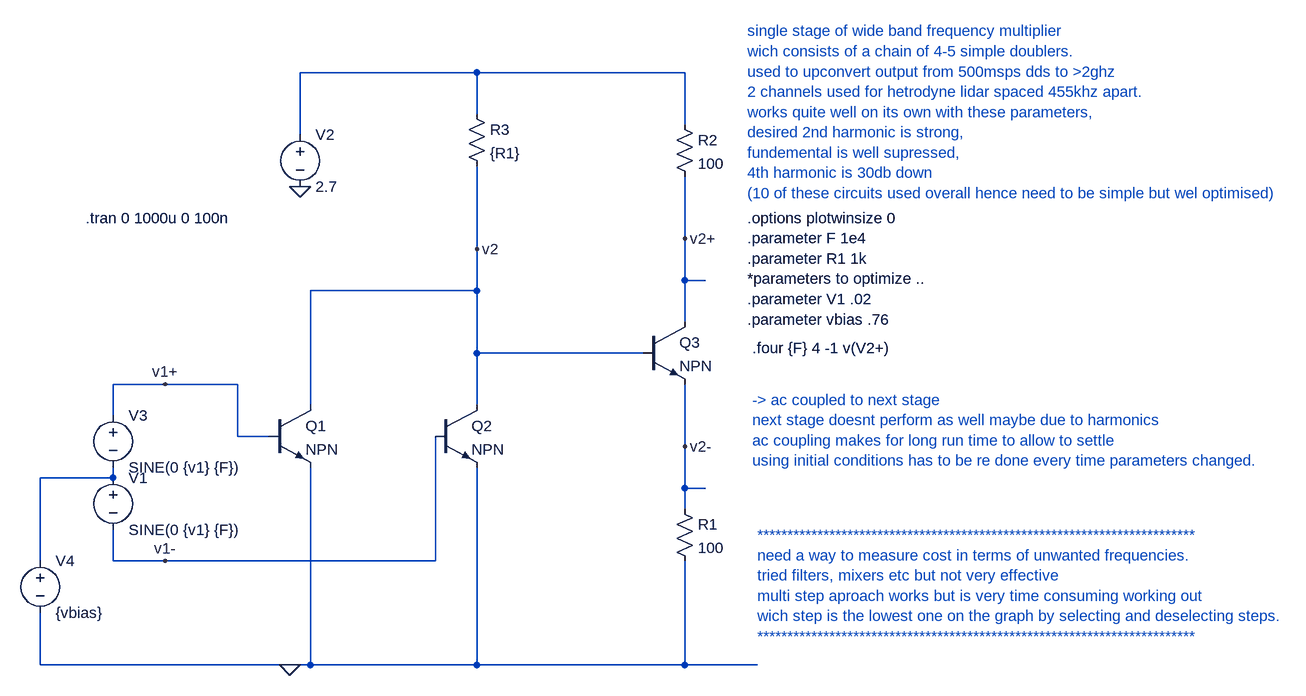
[diagram p0: schematic mul_x2_a.asc]
mul_x2_a.asc, the LTspice schematic file:
Version 4
SHEET 1 4328 788
WIRE -336 480 -336 352
WIRE -336 640 -336 560
WIRE -224 256 -224 208
WIRE -224 352 -336 352
WIRE -224 352 -224 336
WIRE -224 480 -224 432
WIRE -144 208 -224 208
WIRE -144 480 -224 480
WIRE -32 208 -144 208
WIRE -32 288 -32 208
WIRE 16 288 -32 288
WIRE 48 640 -336 640
WIRE 64 -176 64 -272
WIRE 80 240 80 64
WIRE 80 640 48 640
WIRE 80 640 80 336
WIRE 272 480 -144 480
WIRE 272 480 272 288
WIRE 336 -272 64 -272
WIRE 336 -208 336 -272
WIRE 336 0 336 -128
WIRE 336 64 80 64
WIRE 336 64 336 0
WIRE 336 160 336 64
WIRE 336 240 336 160
WIRE 336 640 80 640
WIRE 336 640 336 336
WIRE 592 160 336 160
WIRE 656 -272 336 -272
WIRE 656 -192 656 -272
WIRE 656 -16 656 -112
WIRE 656 48 656 -16
WIRE 656 112 656 48
WIRE 656 304 656 208
WIRE 656 368 656 304
WIRE 656 400 656 368
WIRE 656 640 336 640
WIRE 656 640 656 480
WIRE 688 48 656 48
WIRE 688 368 656 368
WIRE 768 640 656 640
FLAG 64 -96 0
FLAG 48 640 0
FLAG 656 -16 v2+
FLAG 656 304 v2-
FLAG -144 208 v1+
FLAG -144 480 v1-
FLAG 336 0 v2
SYMBOL npn 16 240 R0
SYMATTR InstName Q1
SYMBOL npn 272 240 R0
SYMATTR InstName Q2
SYMBOL npn 592 112 R0
SYMATTR InstName Q3
SYMBOL res 640 384 R0
SYMATTR InstName R1
SYMATTR Value 100
SYMBOL res 640 -208 R0
SYMATTR InstName R2
SYMATTR Value 100
SYMBOL res 320 -224 R0
SYMATTR InstName R3
SYMATTR Value {R1}
SYMBOL voltage -224 336 R0
WINDOW 123 0 0 Left 0
WINDOW 39 0 0 Left 0
SYMATTR InstName V1
SYMATTR Value SINE(0 {v1} {F})
SYMBOL voltage 64 -192 R0
WINDOW 123 0 0 Left 0
WINDOW 39 0 0 Left 0
SYMATTR InstName V2
SYMATTR Value 2.7
SYMBOL voltage -224 240 R0
WINDOW 123 0 0 Left 0
WINDOW 39 0 0 Left 0
SYMATTR InstName V3
SYMATTR Value SINE(0 {v1} {F})
SYMBOL voltage -336 464 R0
WINDOW 123 0 0 Left 0
WINDOW 39 0 0 Left 0
SYMATTR InstName V4
SYMATTR Value {vbias}
TEXT -266 -48 Left 0 !.tran 0 1000u 0 100n
TEXT 752 -48 Left 0 !.options plotwinsize 0\n.parameter F 1e4\n.parameter R1 1k\n*parameters to optimize ..\n.parameter V1 .02\n.parameter vbias .76
TEXT 760 232 Left 0 ;-> ac coupled to next stage\nnext stage doesnt perform as well maybe due to harmonics\nac coupling makes for long run time to allow to settle\nusing initial conditions has to be re done every time parameters changed.
TEXT 752 -336 Left 0 ;single stage of wide band frequency multiplier \nwich consists of a chain of 4-5 simple doublers.\nused to upconvert output from 500msps dds to >2ghz\n2 channels used for hetrodyne lidar spaced 455khz apart.\nworks quite well on its own with these parameters, \ndesired 2nd harmonic is strong,\nfundemental is well supressed,\n4th harmonic is 30db down\n(10 of these circuits used overall hence need to be simple but wel optimised)
TEXT 768 440 Left 0 ;*************************************************************************\nneed a way to measure cost in terms of unwanted frequencies.\ntried filters, mixers etc but not very effective\nmulti step aproach works but is very time consuming working out \nwich step is the lowest one on the graph by selecting and deselecting steps.\n*************************************************************************
TEXT 760 152 Left 0 !.four {F} 4 -1 v(V2+)

The netlist it stands for:
* mul_x2_a.asc
Q1 v2 v1+ 0 0 NPN
Q2 v2 v1- 0 0 NPN
Q3 v2+ v2 v2- 0 NPN
R1 v2- 0 100
R2 N002 v2+ 100
R3 N002 v2 {R1}
V1 N001 v1- SINE(0 {v1} {F})
V2 N002 0 2.7
V3 v1+ N001 SINE(0 {v1} {F})
V4 N001 0 {vbias}
.model NPN NPN
.model PNP PNP
.lib standard.bjt
.tran 0 1000u 0 100n
.options plotwinsize 0
.parameter F 1e4
.parameter R1 1k
*parameters to optimize ..
.parameter V1 .02
.parameter vbias .76
* -> ac coupled to next stage
* next stage doesnt perform as well maybe due to harmonics
* ac coupling makes for long run time to allow to settle
* using initial conditions has to be re done every time parameters changed.
* single stage of wide band frequency multiplier
* wich consists of a chain of 4-5 simple doublers.
* used to upconvert output from 500msps dds to >2ghz
* 2 channels used for hetrodyne lidar spaced 455khz apart.
* works quite well on its own with these parameters,
* desired 2nd harmonic is strong,
* fundemental is well supressed,
* 4th harmonic is 30db down
* (10 of these circuits used overall hence need to be simple but wel optimised)
* *************************************************************************
* need a way to measure cost in terms of unwanted frequencies.
* tried filters, mixers etc but not very effective
* multi step aproach works but is very time consuming working out
* wich step is the lowest one on the graph by selecting and deselecting steps.
* *************************************************************************
.four {F} 4 -1 v(V2+)
.backanno
.end